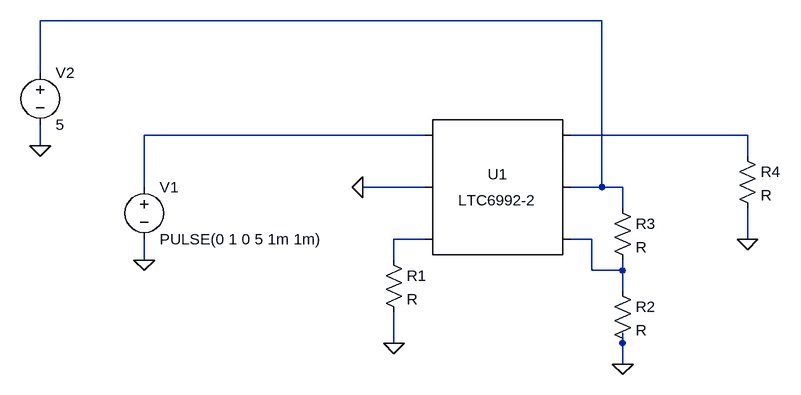
[diagram p0: schematic LTC6992_PWM_temperature.asc]
LTC6992_PWM_temperature.asc, the LTspice schematic file:
Version 4
SHEET 1 880 680
WIRE 320 -272 -544 -272
WIRE -544 -192 -544 -272
WIRE 48 -96 -384 -96
WIRE 544 -96 272 -96
WIRE -544 -80 -544 -112
WIRE 544 -64 544 -96
WIRE -384 -16 -384 -96
WIRE 48 -16 -48 -16
WIRE 320 -16 320 -272
WIRE 320 -16 272 -16
WIRE 352 -16 320 -16
WIRE 352 16 352 -16
WIRE 48 64 0 64
WIRE 304 64 272 64
WIRE 544 64 544 16
WIRE -384 96 -384 64
WIRE 0 96 0 64
WIRE 304 112 304 64
WIRE 352 112 352 96
WIRE 352 112 304 112
WIRE 352 144 352 112
WIRE 0 224 0 176
WIRE 352 224 352 208
WIRE 352 256 352 224
FLAG -48 -16 0
FLAG -384 96 0
FLAG -544 -80 0
FLAG 352 256 0
FLAG 0 224 0
FLAG 544 64 0
SYMBOL SpecialFunctions\\LTC6992-2 160 -16 R0
SYMATTR InstName U1
SYMBOL voltage -384 -32 R0
WINDOW 123 0 0 Left 2
WINDOW 39 0 0 Left 2
SYMATTR InstName V1
SYMATTR Value PULSE(0 1 0 5 1m 1m)
SYMBOL voltage -544 -208 R0
WINDOW 123 0 0 Left 2
WINDOW 39 0 0 Left 2
SYMATTR InstName V2
SYMATTR Value 5
SYMBOL res -16 80 R0
SYMATTR InstName R1
SYMBOL res 336 128 R0
SYMATTR InstName R2
SYMBOL res 336 0 R0
SYMATTR InstName R3
SYMBOL res 528 -80 R0
SYMATTR InstName R4

The netlist it stands for:
* LTC6992_PWM_temperature.asc
XU1 N002 0 N004 N005 N001 N003 LTC6992-2
V1 N002 0 PULSE(0 1 0 5 1m 1m)
V2 N001 0 5
R1 N004 0 R
R2 N005 0 R
R3 N001 N005 R
R4 N003 0 R
.lib LTC6992-2.sub
.backanno
.end